# EAGLE schematic guts (EAGLE 6.6.0)
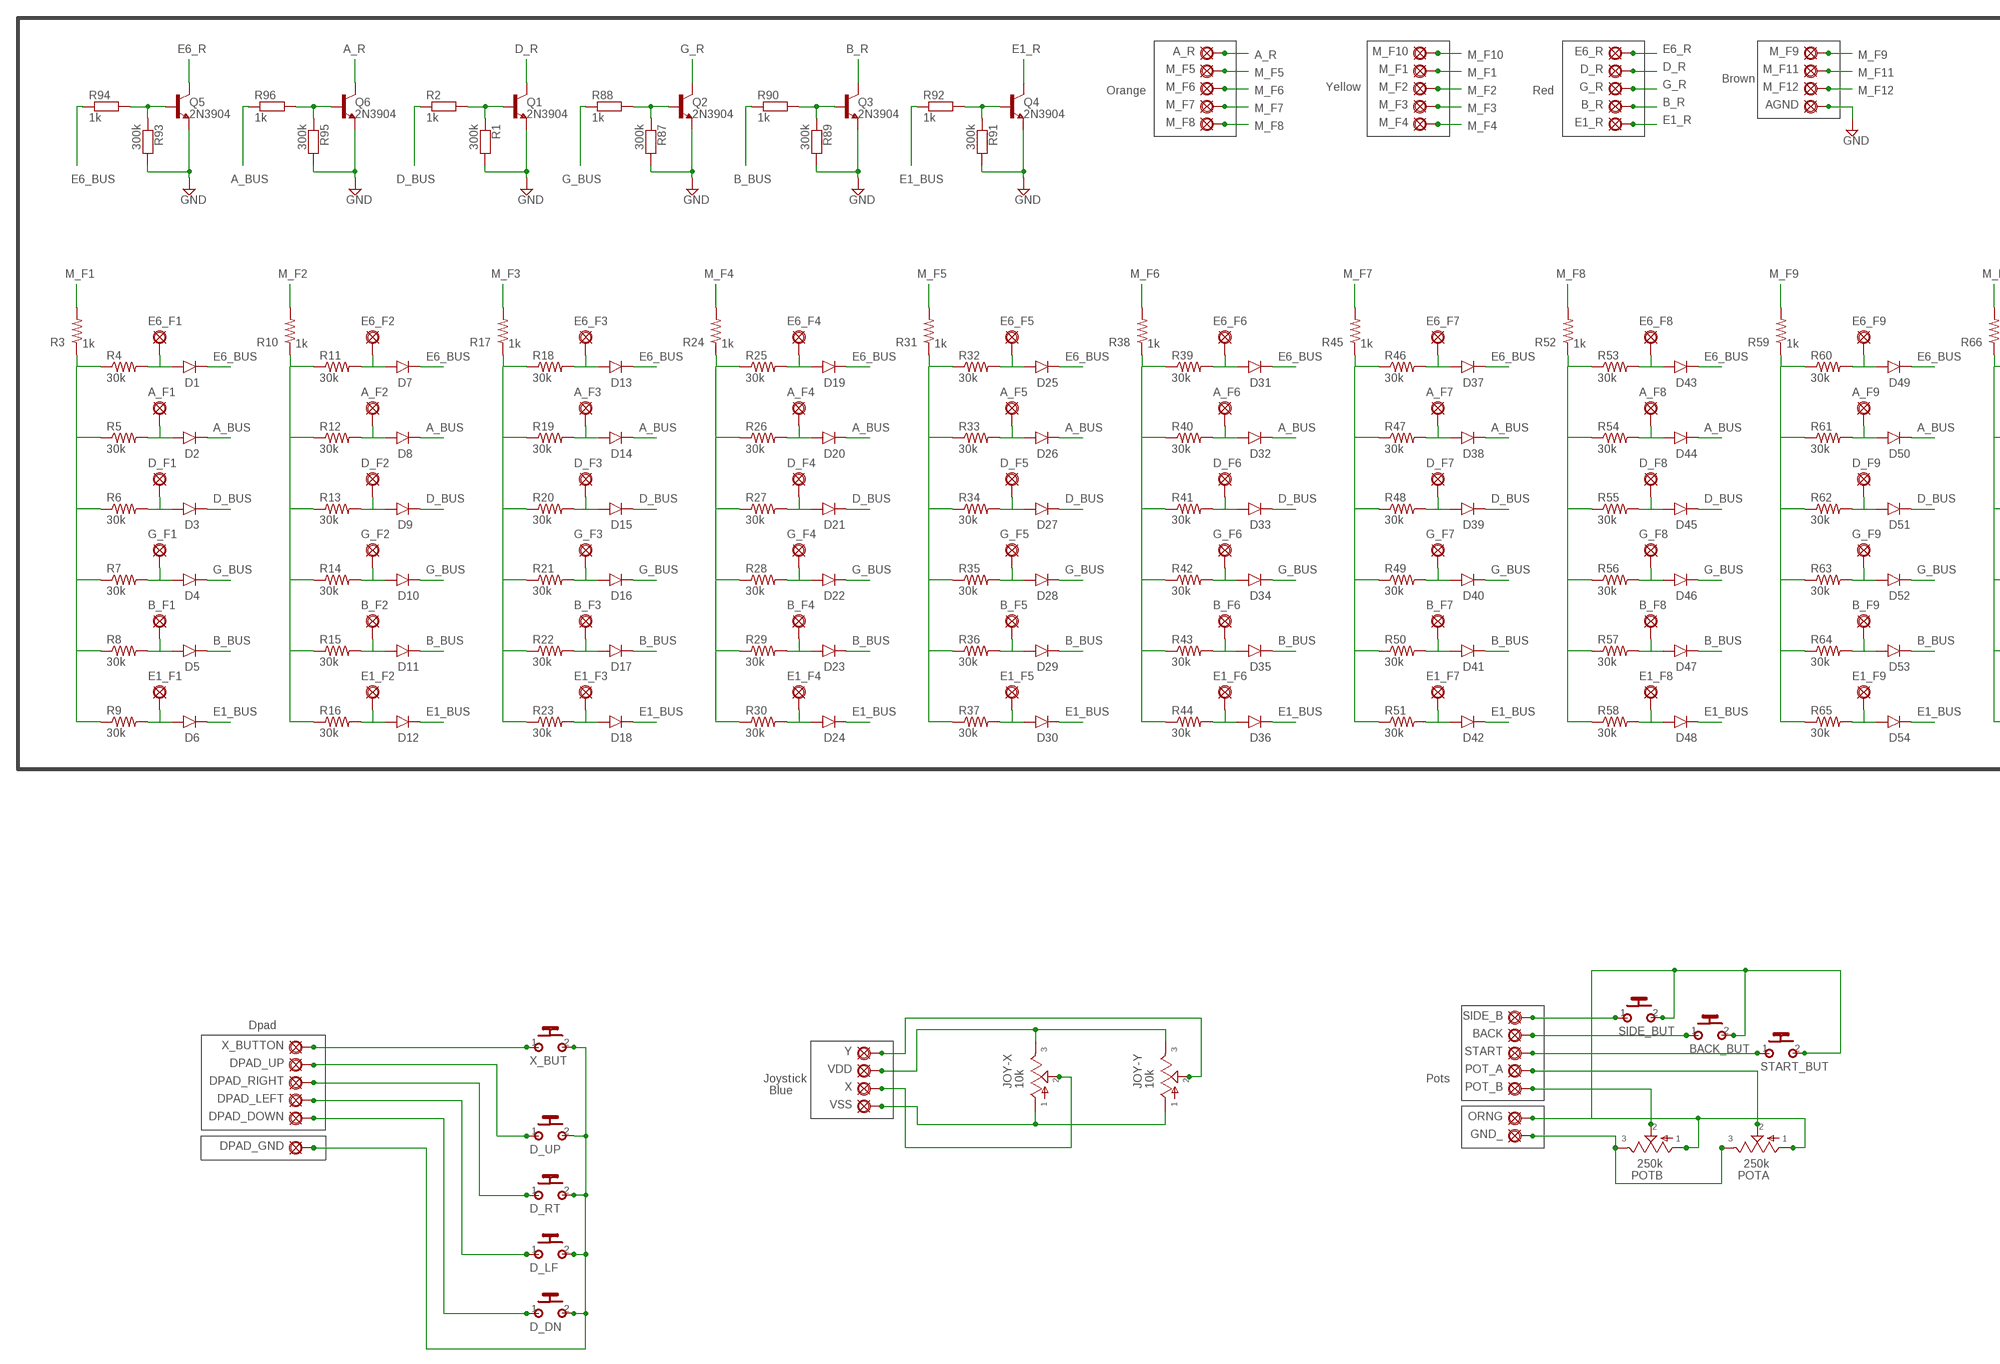
[diagram p0: schematic, sheet 1, part 1 of 2]
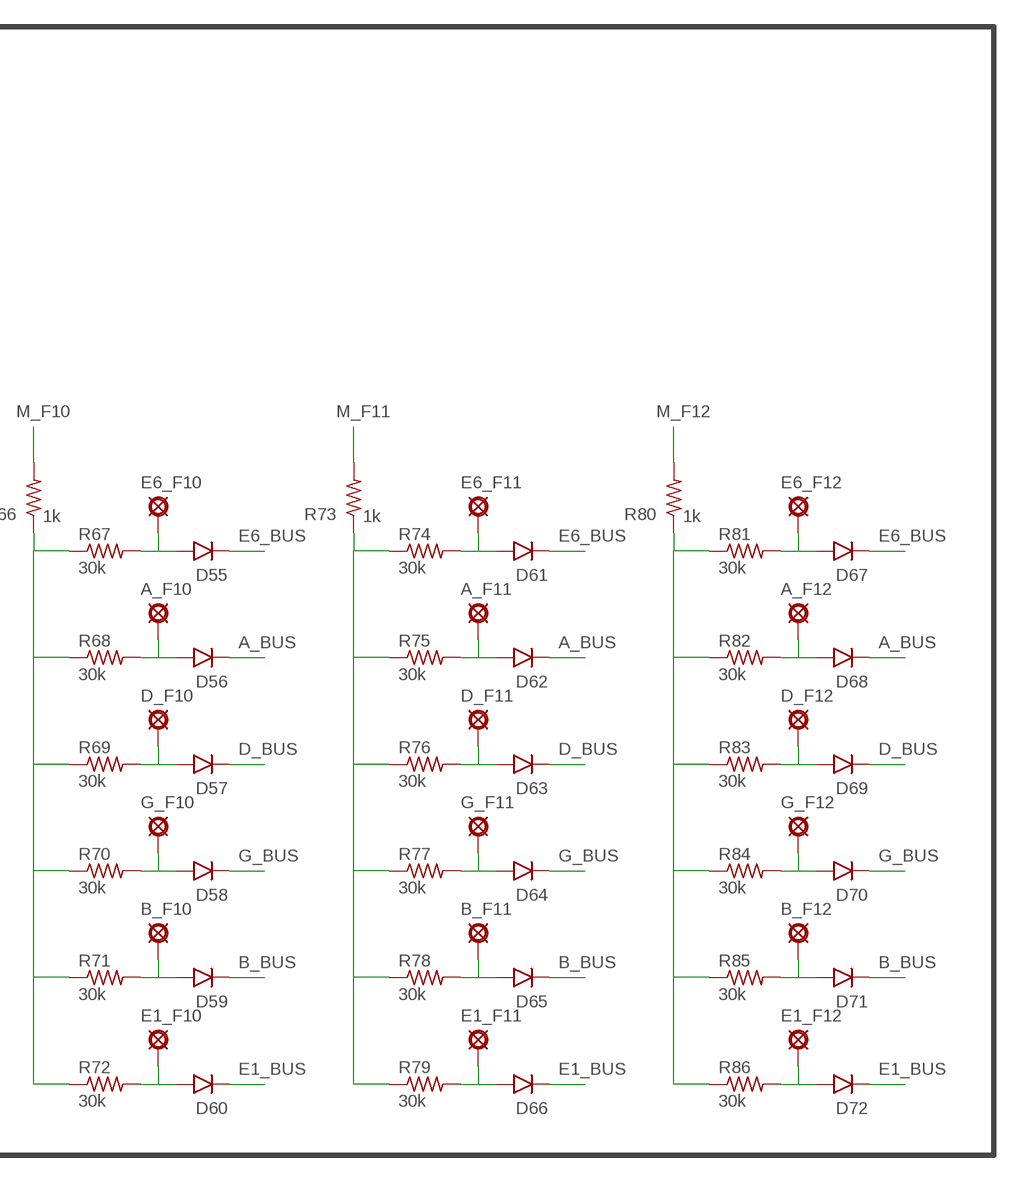
[diagram p1: schematic, sheet 1, part 2 of 2]

## Parts
A_F1  PAD  [SQUARE]
A_F2  PAD  [SQUARE]
A_F3  PAD  [SQUARE]
A_F4  PAD  [SQUARE]
A_F5  PAD  [SQUARE]
A_F6  PAD  [SQUARE]
A_F7  PAD  [SQUARE]
A_F8  PAD  [SQUARE]
A_F9  PAD  [SQUARE]
A_F10  PAD  [SQUARE]
A_F11  PAD  [SQUARE]
A_F12  PAD  [SQUARE]
A_R  PAD8  [OCTOGON]
AGND  PAD8  [OCTOGON]
B_F1  PAD  [SQUARE]
B_F2  PAD  [SQUARE]
B_F3  PAD  [SQUARE]
B_F4  PAD  [SQUARE]
B_F5  PAD  [SQUARE]
B_F6  PAD  [SQUARE]
B_F7  PAD  [SQUARE]
B_F8  PAD  [SQUARE]
B_F9  PAD  [SQUARE]
B_F10  PAD  [SQUARE]
B_F11  PAD  [SQUARE]
B_F12  PAD  [SQUARE]
B_R  PAD8  [OCTOGON]
BACK  PAD8  [OCTOGON]
BACK_BUT  MOMENTARY  [SPST]
D1  1N4148-2  [DO35-2]
D2  1N4148-2  [DO35-2]
D3  1N4148-2  [DO35-2]
D4  1N4148-2  [DO35-2]
D5  1N4148-2  [DO35-2]
D6  1N4148-2  [DO35-2]
D7  1N4148-2  [DO35-2]
D8  1N4148-2  [DO35-2]
D9  1N4148-2  [DO35-2]
D10  1N4148-2  [DO35-2]
D11  1N4148-2  [DO35-2]
D12  1N4148-2  [DO35-2]
D13  1N4148-2  [DO35-2]
D14  1N4148-2  [DO35-2]
D15  1N4148-2  [DO35-2]
D16  1N4148-2  [DO35-2]
D17  1N4148-2  [DO35-2]
D18  1N4148-2  [DO35-2]
D19  1N4148-2  [DO35-2]
D20  1N4148-2  [DO35-2]
D21  1N4148-2  [DO35-2]
D22  1N4148-2  [DO35-2]
D23  1N4148-2  [DO35-2]
D24  1N4148-2  [DO35-2]
D25  1N4148-2  [DO35-2]
D26  1N4148-2  [DO35-2]
D27  1N4148-2  [DO35-2]
D28  1N4148-2  [DO35-2]
D29  1N4148-2  [DO35-2]
D30  1N4148-2  [DO35-2]
D31  1N4148-2  [DO35-2]
D32  1N4148-2  [DO35-2]
D33  1N4148-2  [DO35-2]
D34  1N4148-2  [DO35-2]
D35  1N4148-2  [DO35-2]
D36  1N4148-2  [DO35-2]
D37  1N4148-2  [DO35-2]
D38  1N4148-2  [DO35-2]
D39  1N4148-2  [DO35-2]
D40  1N4148-2  [DO35-2]
D41  1N4148-2  [DO35-2]
D42  1N4148-2  [DO35-2]
D43  1N4148-2  [DO35-2]
D44  1N4148-2  [DO35-2]
D45  1N4148-2  [DO35-2]
D46  1N4148-2  [DO35-2]
D47  1N4148-2  [DO35-2]
D48  1N4148-2  [DO35-2]
D49  1N4148-2  [DO35-2]
D50  1N4148-2  [DO35-2]
D51  1N4148-2  [DO35-2]
D52  1N4148-2  [DO35-2]
D53  1N4148-2  [DO35-2]
D54  1N4148-2  [DO35-2]
D55  1N4148-2  [DO35-2]
D56  1N4148-2  [DO35-2]
D57  1N4148-2  [DO35-2]
D58  1N4148-2  [DO35-2]
D59  1N4148-2  [DO35-2]
D60  1N4148-2  [DO35-2]
D61  1N4148-2  [DO35-2]
D62  1N4148-2  [DO35-2]
D63  1N4148-2  [DO35-2]
D64  1N4148-2  [DO35-2]
D65  1N4148-2  [DO35-2]
D66  1N4148-2  [DO35-2]
D67  1N4148-2  [DO35-2]
D68  1N4148-2  [DO35-2]
D69  1N4148-2  [DO35-2]
D70  1N4148-2  [DO35-2]
D71  1N4148-2  [DO35-2]
D72  1N4148-2  [DO35-2]
D_DN  MOMENTARY  [SPST]
D_F1  PAD  [SQUARE]
D_F2  PAD  [SQUARE]
D_F3  PAD  [SQUARE]
D_F4  PAD  [SQUARE]
D_F5  PAD  [SQUARE]
D_F6  PAD  [SQUARE]
D_F7  PAD  [SQUARE]
D_F8  PAD  [SQUARE]
D_F9  PAD  [SQUARE]
D_F10  PAD  [SQUARE]
D_F11  PAD  [SQUARE]
D_F12  PAD  [SQUARE]
D_LF  MOMENTARY  [SPST]
D_R  PAD8  [OCTOGON]
D_RT  MOMENTARY  [SPST]
D_UP  MOMENTARY  [SPST]
DPAD_DOWN  PAD  [SQUARE]
DPAD_GND  PAD  [SQUARE]
DPAD_LEFT  PAD8  [OCTOGON]
DPAD_RIGHT  PAD8  [OCTOGON]
DPAD_UP  PAD8  [OCTOGON]
E1_F1  PAD  [SQUARE]
E1_F2  PAD  [SQUARE]
E1_F3  PAD  [SQUARE]
E1_F4  PAD  [SQUARE]
E1_F5  PAD  [SQUARE]
E1_F6  PAD  [SQUARE]
E1_F7  PAD  [SQUARE]
E1_F8  PAD  [SQUARE]
E1_F9  PAD  [SQUARE]
E1_F10  PAD  [SQUARE]
E1_F11  PAD  [SQUARE]
E1_F12  PAD  [SQUARE]
E1_R  PAD  [SQUARE]
E6_F1  PAD  [SQUARE]
E6_F2  PAD  [SQUARE]
E6_F3  PAD  [SQUARE]
E6_F4  PAD  [SQUARE]
E6_F5  PAD  [SQUARE]
E6_F6  PAD  [SQUARE]
E6_F7  PAD  [SQUARE]
E6_F8  PAD  [SQUARE]
E6_F9  PAD  [SQUARE]
E6_F10  PAD  [SQUARE]
E6_F11  PAD  [SQUARE]
E6_F12  PAD  [SQUARE]
E6_R  PAD8  [OCTOGON]
G_F1  PAD  [SQUARE]
G_F2  PAD  [SQUARE]
G_F3  PAD  [SQUARE]
G_F4  PAD  [SQUARE]
G_F5  PAD  [SQUARE]
G_F6  PAD  [SQUARE]
G_F7  PAD  [SQUARE]
G_F8  PAD  [SQUARE]
G_F9  PAD  [SQUARE]
G_F10  PAD  [SQUARE]
G_F11  PAD  [SQUARE]
G_F12  PAD  [SQUARE]
G_R  PAD8  [OCTOGON]
GND_  PAD8  [OCTOGON]
JOY-X  10k  POTO  [16MM-OCTA]
JOY-Y  10k  POTO  [16MM-OCTA]
M_F1  PAD8  [OCTOGON]
M_F2  PAD8  [OCTOGON]
M_F3  PAD8  [OCTOGON]
M_F4  PAD  [SQUARE]
M_F5  PAD8  [OCTOGON]
M_F6  PAD8  [OCTOGON]
M_F7  PAD8  [OCTOGON]
M_F8  PAD  [SQUARE]
M_F9  PAD8  [OCTOGON]
M_F10  PAD8  [OCTOGON]
M_F11  PAD8  [OCTOGON]
M_F12  PAD8  [OCTOGON]
ORNG  PAD8  [OCTOGON]
POT_A  PAD8  [OCTOGON]
POT_B  PAD  [SQUARE]
POTA  250k  POTO  [16MM-OCTA]
POTB  250k  POTO  [16MM-OCTA]
Q1  2N3904  [TO92-]
Q2  2N3904  [TO92-]
Q3  2N3904  [TO92-]
Q4  2N3904  [TO92-]
Q5  2N3904  [TO92-]
Q6  2N3904  [TO92-]
R1  300k  6MM-EU  [R0207/3]
R2  1k  6MM-EU  [R0207/3]
R3  1k  6MM.3  [R0207/3]
R4  30k  6MM.3  [R0207/3]
R5  30k  6MM.3  [R0207/3]
R6  30k  6MM.3  [R0207/3]
R7  30k  6MM.3  [R0207/3]
R8  30k  6MM.3  [R0207/3]
R9  30k  6MM.3  [R0207/3]
R10  1k  6MM.3  [R0207/3]
R11  30k  6MM.3  [R0207/3]
R12  30k  6MM.3  [R0207/3]
R13  30k  6MM.3  [R0207/3]
R14  30k  6MM.3  [R0207/3]
R15  30k  6MM.3  [R0207/3]
R16  30k  6MM.3  [R0207/3]
R17  1k  6MM.3  [R0207/3]
R18  30k  6MM.3  [R0207/3]
R19  30k  6MM.3  [R0207/3]
R20  30k  6MM.3  [R0207/3]
R21  30k  6MM.3  [R0207/3]
R22  30k  6MM.3  [R0207/3]
R23  30k  6MM.3  [R0207/3]
R24  1k  6MM.3  [R0207/3]
R25  30k  6MM.3  [R0207/3]
R26  30k  6MM.3  [R0207/3]
R27  30k  6MM.3  [R0207/3]
R28  30k  6MM.3  [R0207/3]
R29  30k  6MM.3  [R0207/3]
R30  30k  6MM.3  [R0207/3]
R31  1k  6MM.3  [R0207/3]
R32  30k  6MM.3  [R0207/3]
R33  30k  6MM.3  [R0207/3]
R34  30k  6MM.3  [R0207/3]
R35  30k  6MM.3  [R0207/3]
R36  30k  6MM.3  [R0207/3]
R37  30k  6MM.3  [R0207/3]
R38  1k  6MM.3  [R0207/3]
R39  30k  6MM.3  [R0207/3]
R40  30k  6MM.3  [R0207/3]
R41  30k  6MM.3  [R0207/3]
R42  30k  6MM.3  [R0207/3]
R43  30k  6MM.3  [R0207/3]
R44  30k  6MM.3  [R0207/3]
R45  1k  6MM.3  [R0207/3]
R46  30k  6MM.3  [R0207/3]
R47  30k  6MM.3  [R0207/3]
R48  30k  6MM.3  [R0207/3]
R49  30k  6MM.3  [R0207/3]
R50  30k  6MM.3  [R0207/3]
R51  30k  6MM.3  [R0207/3]
R52  1k  6MM.3  [R0207/3]
R53  30k  6MM.3  [R0207/3]
R54  30k  6MM.3  [R0207/3]
R55  30k  6MM.3  [R0207/3]
R56  30k  6MM.3  [R0207/3]
R57  30k  6MM.3  [R0207/3]
R58  30k  6MM.3  [R0207/3]
R59  1k  6MM.3  [R0207/3]
R60  30k  6MM.3  [R0207/3]
R61  30k  6MM.3  [R0207/3]
R62  30k  6MM.3  [R0207/3]
R63  30k  6MM.3  [R0207/3]
R64  30k  6MM.3  [R0207/3]
R65  30k  6MM.3  [R0207/3]
R66  1k  6MM.3  [R0207/3]
R67  30k  6MM.3  [R0207/3]
R68  30k  6MM.3  [R0207/3]
R69  30k  6MM.3  [R0207/3]
R70  30k  6MM.3  [R0207/3]
R71  30k  6MM.3  [R0207/3]
R72  30k  6MM.3  [R0207/3]
R73  1k  6MM.3  [R0207/3]
R74  30k  6MM.3  [R0207/3]
R75  30k  6MM.3  [R0207/3]
R76  30k  6MM.3  [R0207/3]
R77  30k  6MM.3  [R0207/3]
R78  30k  6MM.3  [R0207/3]
R79  30k  6MM.3  [R0207/3]
R80  1k  6MM.3  [R0207/3]
R81  30k  6MM.3  [R0207/3]
R82  30k  6MM.3  [R0207/3]
R83  30k  6MM.3  [R0207/3]
R84  30k  6MM.3  [R0207/3]
R85  30k  6MM.3  [R0207/3]
R86  30k  6MM.3  [R0207/3]
R87  300k  6MM-EU  [R0207/3]
R88  1k  6MM-EU  [R0207/3]
R89  300k  6MM-EU  [R0207/3]
R90  1k  6MM-EU  [R0207/3]
R91  300k  6MM-EU  [R0207/3]
R92  1k  6MM-EU  [R0207/3]
R93  300k  6MM-EU  [R0207/3]
R94  1k  6MM-EU  [R0207/3]
R95  300k  6MM-EU  [R0207/3]
R96  1k  6MM-EU  [R0207/3]
SIDE_B  PAD8  [OCTOGON]
SIDE_BUT  MOMENTARY  [SPST]
START  PAD8  [OCTOGON]
START_BUT  MOMENTARY  [SPST]
VDD  PAD8  [OCTOGON]
VSS  PAD8  [OCTOGON]
X  PAD8  [OCTOGON]
X_BUT  MOMENTARY  [SPST]
X_BUTTON  PAD8  [OCTOGON]
Y  PAD8  [OCTOGON]

## Nets
A_BUS: D2.C D8.C D14.C D20.C D26.C D32.C D38.C D44.C D50.C D56.C D62.C D68.C R96.1
A_R: A_R.1(PAD) Q6.1(C)
B_BUS: D5.C D11.C D17.C D23.C D29.C D35.C D41.C D47.C D53.C D59.C D65.C D71.C R90.1
B_R: Q3.1(C)
D_BUS: D3.C D9.C D15.C D21.C D27.C D33.C D39.C D45.C D51.C D57.C D63.C D69.C R2.1
D_DOWN: D_DN.1(P) DPAD_DOWN.1(PAD)
D_LEFT: D_LF.1(P)
D_R: D_R.1(PAD) Q1.1(C)
D_RIGHT: D_RT.1(P) DPAD_RIGHT.1(PAD)
D_UP: D_UP.1(P) DPAD_UP.1(PAD)
E1_BUS: D6.C D12.C D18.C D24.C D30.C D36.C D42.C D48.C D54.C D60.C D66.C D72.C R92.1
E1_R: E1_R.1(PAD) Q4.1(C)
E6_BUS: D1.C D7.C D13.C D19.C D25.C D31.C D37.C D43.C D49.C D55.C D61.C D67.C R94.1
E6_R: E6_R.1(PAD) Q5.1(C)
G_BUS: D4.C D10.C D16.C D22.C D28.C D34.C D40.C D46.C D52.C D58.C D64.C D70.C R88.1
G_R: G_R.1(PAD) Q2.1(C)
GND: Q1.3(E) Q2.3(E) Q3.3(E) Q4.3(E) Q5.3(E) Q6.3(E) R1.2 R87.2 R89.2 R91.2 R93.2 R95.2
M_F1: M_F1.1(PAD) R3.2
M_F2: M_F2.1(PAD) R10.2
M_F3: R17.2
M_F4: M_F4.1(PAD) R24.2
M_F5: M_F5.1(PAD) R31.2
M_F6: M_F6.1(PAD) R38.2
M_F7: R45.2
M_F8: M_F8.1(PAD) R52.2
M_F9: M_F9.1(PAD) R59.2
M_F10: M_F10.1(PAD) R66.2
M_F11: M_F11.1(PAD) R73.2
M_F12: M_F12.1(PAD) R80.2
N$1: JOY-X.1 JOY-Y.1 VSS.1(PAD)
N$2: Q1.2(B) R1.1 R2.2
N$3: D1.A E6_F1.1(PAD) R4.2
N$4: D7.A E6_F2.1(PAD) R11.2
N$5: A_F2.1(PAD) D8.A R12.2
N$6: A_F1.1(PAD) D2.A R5.2
N$7: D9.A D_F2.1(PAD) R13.2
N$8: D10.A G_F2.1(PAD) R14.2
N$9: D3.A D_F1.1(PAD) R6.2
N$10: B_F2.1(PAD) D11.A R15.2
N$11: D12.A E1_F2.1(PAD) R16.2
N$12: D4.A G_F1.1(PAD) R7.2
N$13: R10.1 R11.1 R12.1 R13.1 R14.1 R15.1 R16.1
N$14: D13.A E6_F3.1(PAD) R18.2
N$15: B_F1.1(PAD) D5.A R8.2
N$16: M_F7.1(PAD)
N$17: A_F3.1(PAD) D14.A R19.2
N$18: D15.A D_F3.1(PAD) R20.2
N$19: D6.A E1_F1.1(PAD) R9.2
N$20: R3.1 R4.1 R5.1 R6.1 R7.1 R8.1 R9.1
N$21: D16.A G_F3.1(PAD) R21.2
N$22: B_F3.1(PAD) D17.A R22.2
N$23: D18.A E1_F3.1(PAD) R23.2
N$24: R17.1 R18.1 R19.1 R20.1 R21.1 R22.1 R23.1
N$25: D19.A E6_F4.1(PAD) R25.2
N$26: A_F4.1(PAD) D20.A R26.2
N$27: D21.A D_F4.1(PAD) R27.2
N$28: M_F3.1(PAD)
N$29: D22.A G_F4.1(PAD) R28.2
N$30: B_F4.1(PAD) D23.A R29.2
N$31: D24.A E1_F4.1(PAD) R30.2
N$32: R24.1 R25.1 R26.1 R27.1 R28.1 R29.1 R30.1
N$33: D25.A E6_F5.1(PAD) R32.2
N$34: A_F5.1(PAD) D26.A R33.2
N$35: B_R.1(PAD)
N$36: D27.A D_F5.1(PAD) R34.2
N$37: D28.A G_F5.1(PAD) R35.2
N$38: B_F5.1(PAD) D29.A R36.2
N$39: D30.A E1_F5.1(PAD) R37.2
N$40: R31.1 R32.1 R33.1 R34.1 R35.1 R36.1 R37.1
N$41: D31.A E6_F6.1(PAD) R39.2
N$42: A_F6.1(PAD) D32.A R40.2
N$43: D33.A D_F6.1(PAD) R41.2
N$44: D34.A G_F6.1(PAD) R42.2
N$45: B_F6.1(PAD) D35.A R43.2
N$46: D36.A E1_F6.1(PAD) R44.2
N$47: R38.1 R39.1 R40.1 R41.1 R42.1 R43.1 R44.1
N$48: AGND.1(PAD)
N$49: D37.A E6_F7.1(PAD) R46.2
N$50: A_F7.1(PAD) D38.A R47.2
N$51: D39.A D_F7.1(PAD) R48.2
N$52: D40.A G_F7.1(PAD) R49.2
N$53: B_F7.1(PAD) D41.A R50.2
N$54: JOY-X.3 JOY-Y.3 VDD.1(PAD)
N$55: D42.A E1_F7.1(PAD) R51.2
N$56: R45.1 R46.1 R47.1 R48.1 R49.1 R50.1 R51.1
N$57: D43.A E6_F8.1(PAD) R53.2
N$58: A_F8.1(PAD) D44.A R54.2
N$59: D45.A D_F8.1(PAD) R55.2
N$60: SIDE_B.1(PAD) SIDE_BUT.1(P)
N$61: D46.A G_F8.1(PAD) R56.2
N$62: B_F8.1(PAD) D47.A R57.2
N$63: D48.A E1_F8.1(PAD) R58.2
N$64: R52.1 R53.1 R54.1 R55.1 R56.1 R57.1 R58.1
N$65: D49.A E6_F9.1(PAD) R60.2
N$66: DPAD_LEFT.1(PAD)
N$67: A_F9.1(PAD) D50.A R61.2
N$68: D51.A D_F9.1(PAD) R62.2
N$69: D52.A G_F9.1(PAD) R63.2
N$70: B_F9.1(PAD) D53.A R64.2
N$71: D54.A E1_F9.1(PAD) R65.2
N$72: R59.1 R60.1 R61.1 R62.1 R63.1 R64.1 R65.1
N$73: D55.A E6_F10.1(PAD) R67.2
N$74: A_F10.1(PAD) D56.A R68.2
N$75: D57.A D_F10.1(PAD) R69.2
N$76: D58.A G_F10.1(PAD) R70.2
N$77: B_F10.1(PAD) D59.A R71.2
N$78: D60.A E1_F10.1(PAD) R72.2
N$79: R66.1 R67.1 R68.1 R69.1 R70.1 R71.1 R72.1
N$80: D61.A E6_F11.1(PAD) R74.2
N$81: A_F11.1(PAD) D62.A R75.2
N$82: D63.A D_F11.1(PAD) R76.2
N$83: D64.A G_F11.1(PAD) R77.2
N$84: B_F11.1(PAD) D65.A R78.2
N$85: D66.A E1_F11.1(PAD) R79.2
N$86: R73.1 R74.1 R75.1 R76.1 R77.1 R78.1 R79.1
N$87: D67.A E6_F12.1(PAD) R81.2
N$88: A_F12.1(PAD) D68.A R82.2
N$89: D69.A D_F12.1(PAD) R83.2
N$90: D70.A G_F12.1(PAD) R84.2
N$91: B_F12.1(PAD) D71.A R85.2
N$92: D72.A E1_F12.1(PAD) R86.2
N$93: R80.1 R81.1 R82.1 R83.1 R84.1 R85.1 R86.1
N$94: Q2.2(B) R87.1 R88.2
N$95: Q3.2(B) R89.1 R90.2
N$96: Q4.2(B) R91.1 R92.2
N$97: Q5.2(B) R93.1 R94.2
N$98: Q6.2(B) R95.1 R96.2
N$99: D_DN.2(S) D_LF.2(S) D_RT.2(S) D_UP.2(S) DPAD_GND.1(PAD) X_BUT.2(S)
N$100: JOY-Y.2 Y.1(PAD)
N$101: JOY-X.2 X.1(PAD)
N$102: BACK.1(PAD) BACK_BUT.1(P)
N$103: START.1(PAD) START_BUT.1(P)
N$104: POT_A.1(PAD) POTA.2
N$105: POT_B.1(PAD) POTB.2
N$106: GND_.1(PAD) POTA.3 POTB.3
N$107: BACK_BUT.2(S) ORNG.1(PAD) POTA.1 POTB.1 SIDE_BUT.2(S) START_BUT.2(S)
X_BUTTON: X_BUT.1(P) X_BUTTON.1(PAD)

## Notes on the sheet
- Yellow | Brown
- Orange | Red
- Dpad
- Joystick | Pots
- Blue

## Library data of the parts
A_F1-A_F12 A_R AGND B_F1-B_F12 B_R BACK D_F1-D_F12 D_R DPAD_DOWN DPAD_GND DPAD_LEFT DPAD_RIGHT DPAD_UP E1_F1-E1_F12 E1_R E6_F1-E6_F12 E6_R G_F1-G_F12 G_R GND_ M_F1-M_F12 ORNG POT_A POT_B SIDE_B START VDD VSS X X_BUTTON Y = gm-supply:PAD: PAD use this package for pads with any purpose, including input, output, send or return various pad shapes: round, square, octogonal, long, and long offset
BACK_BUT D_DN D_LF D_RT D_UP SIDE_BUT START_BUT X_BUT = gm-switches:MOMENTARY
D1-D72 = gm-diodes:1N4148: Fast Switching Diode DO-35 glass case a.k.a. 1N914
JOY-X JOY-Y POTA POTB = gm-pots:POT: Potentiometers the arrow indicates the clockwise motion of th wiper (lug 2) fully counter clockwise there is no resistance between lugs 1 and 2 fully clockwise the resistance between lugs 1 and 2 is the value of the pot
Q1-Q6 = gm-trans:2N3904: NPN Transistor
R1 R2 R87-R96 = gm-resistors:6MM-EU: 6mm Resistors (European schematic symbol) Leads spaced 1-6 holes apart for 0.1" perfboard. Suitable for 1/4 watt resistors.
R3-R86 = gm-resistors:6MM: 6mm Resistors Leads spaced 1-6 holes apart for 0.1" perfboard. Suitable for 1/4 watt resistors.